# Altium schematic sheet Fabric_IO.SchDoc: uSDR schematic
size Letter; Author: Ye-sheng Kuo; CompanyName: Univ. of Michigan; Revision: 2.0; SheetNumber: 10; SheetTotal: 16
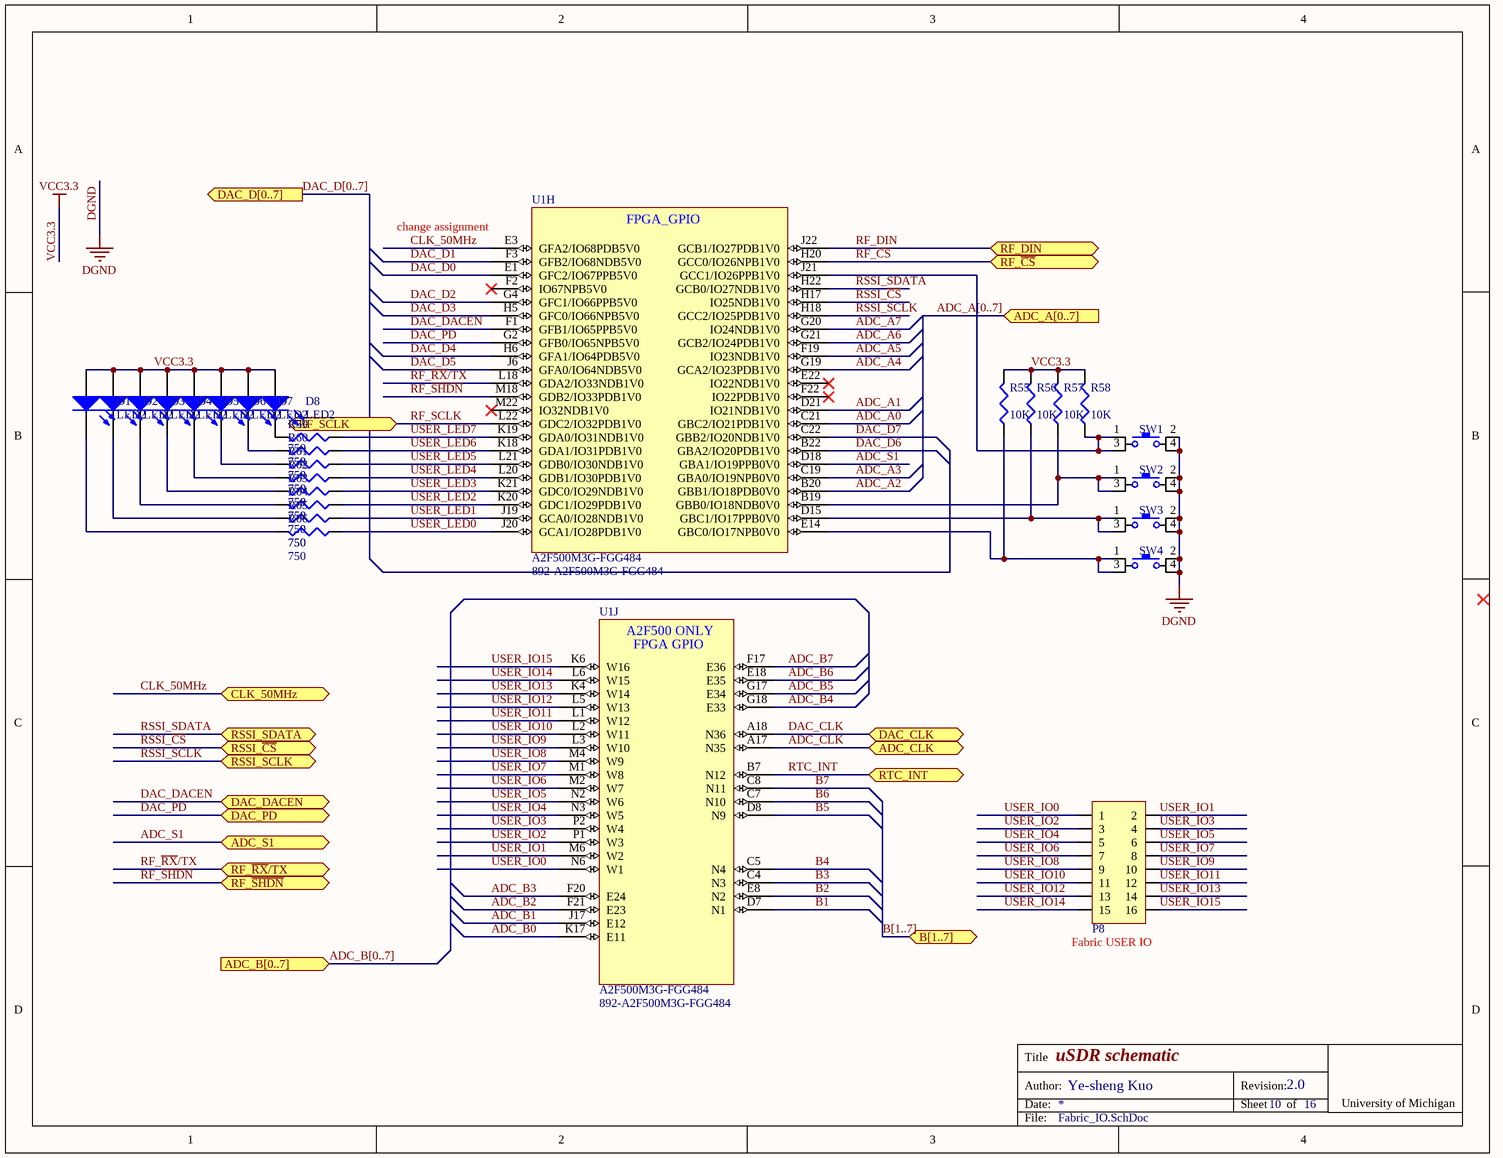
[diagram p0: Fabric_IO.SchDoc]

## Parts
D1  LED2  [1608[0603]]
D2  LED2  [1608[0603]]
D3  LED2  [1608[0603]]
D4  LED2  [1608[0603]]
D5  LED2  [1608[0603]]
D6  LED2  [1608[0603]]
D7  LED2  [1608[0603]]
D8  LED2  [1608[0603]]
P8  2 x 8 header  [2x8 header]  (value not drawn)
R55  10K  [0402]
R56  10K  [0402]
R57  10K  [0402]
R58  10K  [0402]
R59  750  [0402]
R60  750  [0402]
R61  750  [0402]
R62  750  [0402]
R63  750  [0402]
R64  750  [0402]
R65  750  [0402]
R66  750  [0402]
SW1  Switch 4-lead  [KSC403]  (value not drawn)
SW2  Switch 4-lead  [KSC403]  (value not drawn)
SW3  Switch 4-lead  [KSC403]  (value not drawn)
SW4  Switch 4-lead  [KSC403]  (value not drawn)
U1  A2F500M3G-FGG484  Supplier Part Number 1: 892-A2F500M3G-FGG484  [BGA100P22X22-484N]  (parts H,J of 13)

## Ports
ADC_A[0..7] (in), ADC_B[0..7] (in), ADC_CLK (bidir), ADC_S1 (bidir), B[1..7] (bidir), CLK_50MHz (bidir), DAC_CLK (bidir), DAC_D[0..7] (out), DAC_DACEN (bidir), DAC_PD (bidir), RF_DIN (bidir), RF_SCLK (bidir), RF_~{CS} (bidir), RF_~{RX}/TX (bidir), RF_~{SHDN} (bidir), RSSI_SCLK (bidir), RSSI_SDATA (bidir), RSSI_~{CS} (bidir), RTC_INT (bidir)

## Nets
DGND: SW1.2 SW1.4 SW2.2 SW2.4 SW3.2 SW3.4 SW4.2 SW4.4
VCC3.3: D1.1(A) D2.1(A) D3.1(A) D4.1(A) D5.1(A) D6.1(A) D7.1(A) D8.1(A) R55.2 R56.2 R57.2 R58.2
ADC_A0: U1.C21(GBC2/IO21PDB1V0)
ADC_A1: U1.D21(IO21NDB1V0)
ADC_A2: U1.B20(GBB1/IO18PDB0V0)
ADC_A3: U1.C19(GBA0/IO19NPB0V0)
ADC_A4: U1.G19(GCA2/IO23PDB1V0)
ADC_A5: U1.F19(IO23NDB1V0)
ADC_A6: U1.G21(GCB2/IO24PDB1V0)
ADC_A7: U1.G20(IO24NDB1V0)
ADC_B0: U1.K17(E11)
ADC_B1: U1.J17(E12)
ADC_B2: U1.F21(E23)
ADC_B3: U1.F20(E24)
ADC_B4: U1.G18(E33)
ADC_B5: U1.G17(E34)
ADC_B6: U1.E18(E35)
ADC_B7: U1.F17(E36)
ADC_CLK: U1.A17(N35) ; port ADC_CLK
ADC_S1: U1.D18(GBA1/IO19PPB0V0) ; port ADC_S1
B1: U1.D7(N1)
B2: U1.E8(N2)
B3: U1.C4(N3)
B4: U1.C5(N4)
B5: U1.D8(N9)
B6: U1.C7(N10)
B7: U1.C8(N11)
CLK_50MHz: U1.E3(GFA2/IO68PDB5V0) ; port CLK_50MHz
DAC_CLK: U1.A18(N36) ; port DAC_CLK
DAC_D0: U1.E1(GFC2/IO67PPB5V0)
DAC_D1: U1.F3(GFB2/IO68NDB5V0)
DAC_D2: U1.G4(GFC1/IO66PPB5V0)
DAC_D3: U1.H5(GFC0/IO66NPB5V0)
DAC_D4: U1.H6(GFA1/IO64PDB5V0)
DAC_D5: U1.J6(GFA0/IO64NDB5V0)
DAC_D6: U1.B22(GBA2/IO20PDB1V0)
DAC_D7: U1.C22(GBB2/IO20NDB1V0)
DAC_DACEN: U1.F1(GFB1/IO65PPB5V0) ; port DAC_DACEN
DAC_PD: U1.G2(GFB0/IO65NPB5V0) ; port DAC_PD
RF_~{CS}: U1.H20(GCC0/IO26NPB1V0) ; port RF_~{CS}
RF_DIN: U1.J22(GCB1/IO27PDB1V0) ; port RF_DIN
RF_~{RX}/TX: U1.L18(GDA2/IO33NDB1V0) ; port RF_~{RX}/TX
RF_~{SHDN}: U1.M18(GDB2/IO33PDB1V0) ; port RF_~{SHDN}
RF_SCLK: U1.L22(GDC2/IO32PDB1V0) ; port RF_SCLK
RSSI_~{CS}: U1.H17(IO25NDB1V0) ; port RSSI_~{CS}
RSSI_SCLK: U1.H18(GCC2/IO25PDB1V0) ; port RSSI_SCLK
RSSI_SDATA: U1.H22(GCB0/IO27NDB1V0) ; port RSSI_SDATA
RTC_INT: U1.B7(N12) ; port RTC_INT
USER_IO0: P8.1 U1.N6(W1)
USER_IO1: P8.2 U1.M6(W2)
USER_IO2: P8.3 U1.P1(W3)
USER_IO3: P8.4 U1.P2(W4)
USER_IO4: P8.5 U1.N3(W5)
USER_IO5: P8.6 U1.N2(W6)
USER_IO6: P8.7 U1.M2(W7)
USER_IO7: P8.8 U1.M1(W8)
USER_IO8: P8.9 U1.M4(W9)
USER_IO9: P8.10 U1.L3(W10)
USER_IO10: P8.11 U1.L2(W11)
USER_IO11: P8.12 U1.L1(W12)
USER_IO12: P8.13 U1.L5(W13)
USER_IO13: P8.14 U1.K4(W14)
USER_IO14: P8.15 U1.L6(W15)
USER_IO15: P8.16 U1.K6(W16)
USER_LED0: R66.1 U1.J20(GCA1/IO28PDB1V0)
USER_LED1: R65.1 U1.J19(GCA0/IO28NDB1V0)
USER_LED2: R64.1 U1.K20(GDC1/IO29PDB1V0)
USER_LED3: R63.1 U1.K21(GDC0/IO29NDB1V0)
USER_LED4: R62.1 U1.L20(GDB1/IO30PDB1V0)
USER_LED5: R61.1 U1.L21(GDB0/IO30NDB1V0)
USER_LED6: R60.1 U1.K18(GDA1/IO31PDB1V0)
USER_LED7: R59.1 U1.K19(GDA0/IO31NDB1V0)
NetD1_2: D1.2(K) R66.2
NetD2_2: D2.2(K) R65.2
NetD3_2: D3.2(K) R64.2
NetD4_2: D4.2(K) R63.2
NetD5_2: D5.2(K) R62.2
NetD6_2: D6.2(K) R61.2
NetD7_2: D7.2(K) R60.2
NetD8_2: D8.2(K) R59.2
NetR55_1: R55.1 SW4.1 SW4.3 U1.E14(GBC0/IO17NPB0V0)
NetR56_1: R56.1 SW3.1 SW3.3 U1.D15(GBC1/IO17PPB0V0)
NetR57_1: R57.1 SW2.1 SW2.3 U1.B19(GBB0/IO18NDB0V0)
NetR58_1: R58.1 SW1.1 SW1.3 U1.J21(GCC1/IO26PPB1V0)

Not connected (* = marked no-connect by the designer): U1 E22(IO22NDB1V0)* F2(IO67NPB5V0)* F22(IO22PDB1V0)* M22(IO32NDB1V0)*

## Buses and harness runs
bus ADC_A[0..7] = port ADC_A[0..7]
bus ADC_B[0..7] = port ADC_B[0..7]
bus B[1..7] = port B[1..7]
bus DAC_D[0..7] = port DAC_D[0..7]

## Notes on the sheet
- (near U1) change assignment
- (near P8) Fabric USER IO
- Title
- Date:
- Author:
- Revision:
- Sheet
- of
- University of Michigan
- File:
- (in symbol F2-200_500-FGG484_1, part H) FPGA_GPIO
- (in symbol F2-200_500-FGG484_1, part J) A2F500 ONLY; FPGA GPIO

## Library data of the parts
D1-D8 = LED2: Typical RED, GREEN, YELLOW, AMBER GaAs LED; Published: 8-Jun-2000; LatestRevisionDate: 17-Jul-2002; LatestRevisionNote: Re-released for DXP Platform.; PackageVersion: Feb-2002; PackageReference: 3.2X1.6X1.1; Publisher: Altium Limited; PackageDescription: SM LED; 2 Flat Leads
P8 = 2 x 8 header: 100 mils standard header; Supplier 1: Digi-Key; Supplier Part Number 1: 609-3220-ND
R55-R66 = Res3: Resistor; Published: 8-Jun-2000; LatestRevisionDate: 29-May-2009; LatestRevisionNote: IPC-7351 Footprint Added.; PackageReference: J1-0603; Publisher: Altium Limited; PackageDescription: Chip Resistor
  R55-R58: Value: 10K
  R59-R66: Value: 750
SW1-SW4 = Switch 4-lead: Switch; Supplier 1: Digi-Key; Supplier Part Number 1: 401-1776-1-ND; Supplier 2: Digi-Key; Supplier Part Number 2: P8008S-ND
U1 = F2-200_500-FGG484_1: FPGA - Field Programmable Gate Array 500K System Gates; PPS#: P0934R; Supplier 1: Mouser